# EasyEDA Pro project stm32devboard_f401ccu6.eprj

# Schematic Schematic1
Create Date: 2022-06-30; Project Name: stm32devboard_f401ccu6; Schematic Name: Schematic1; Update Date: 2022-07-04
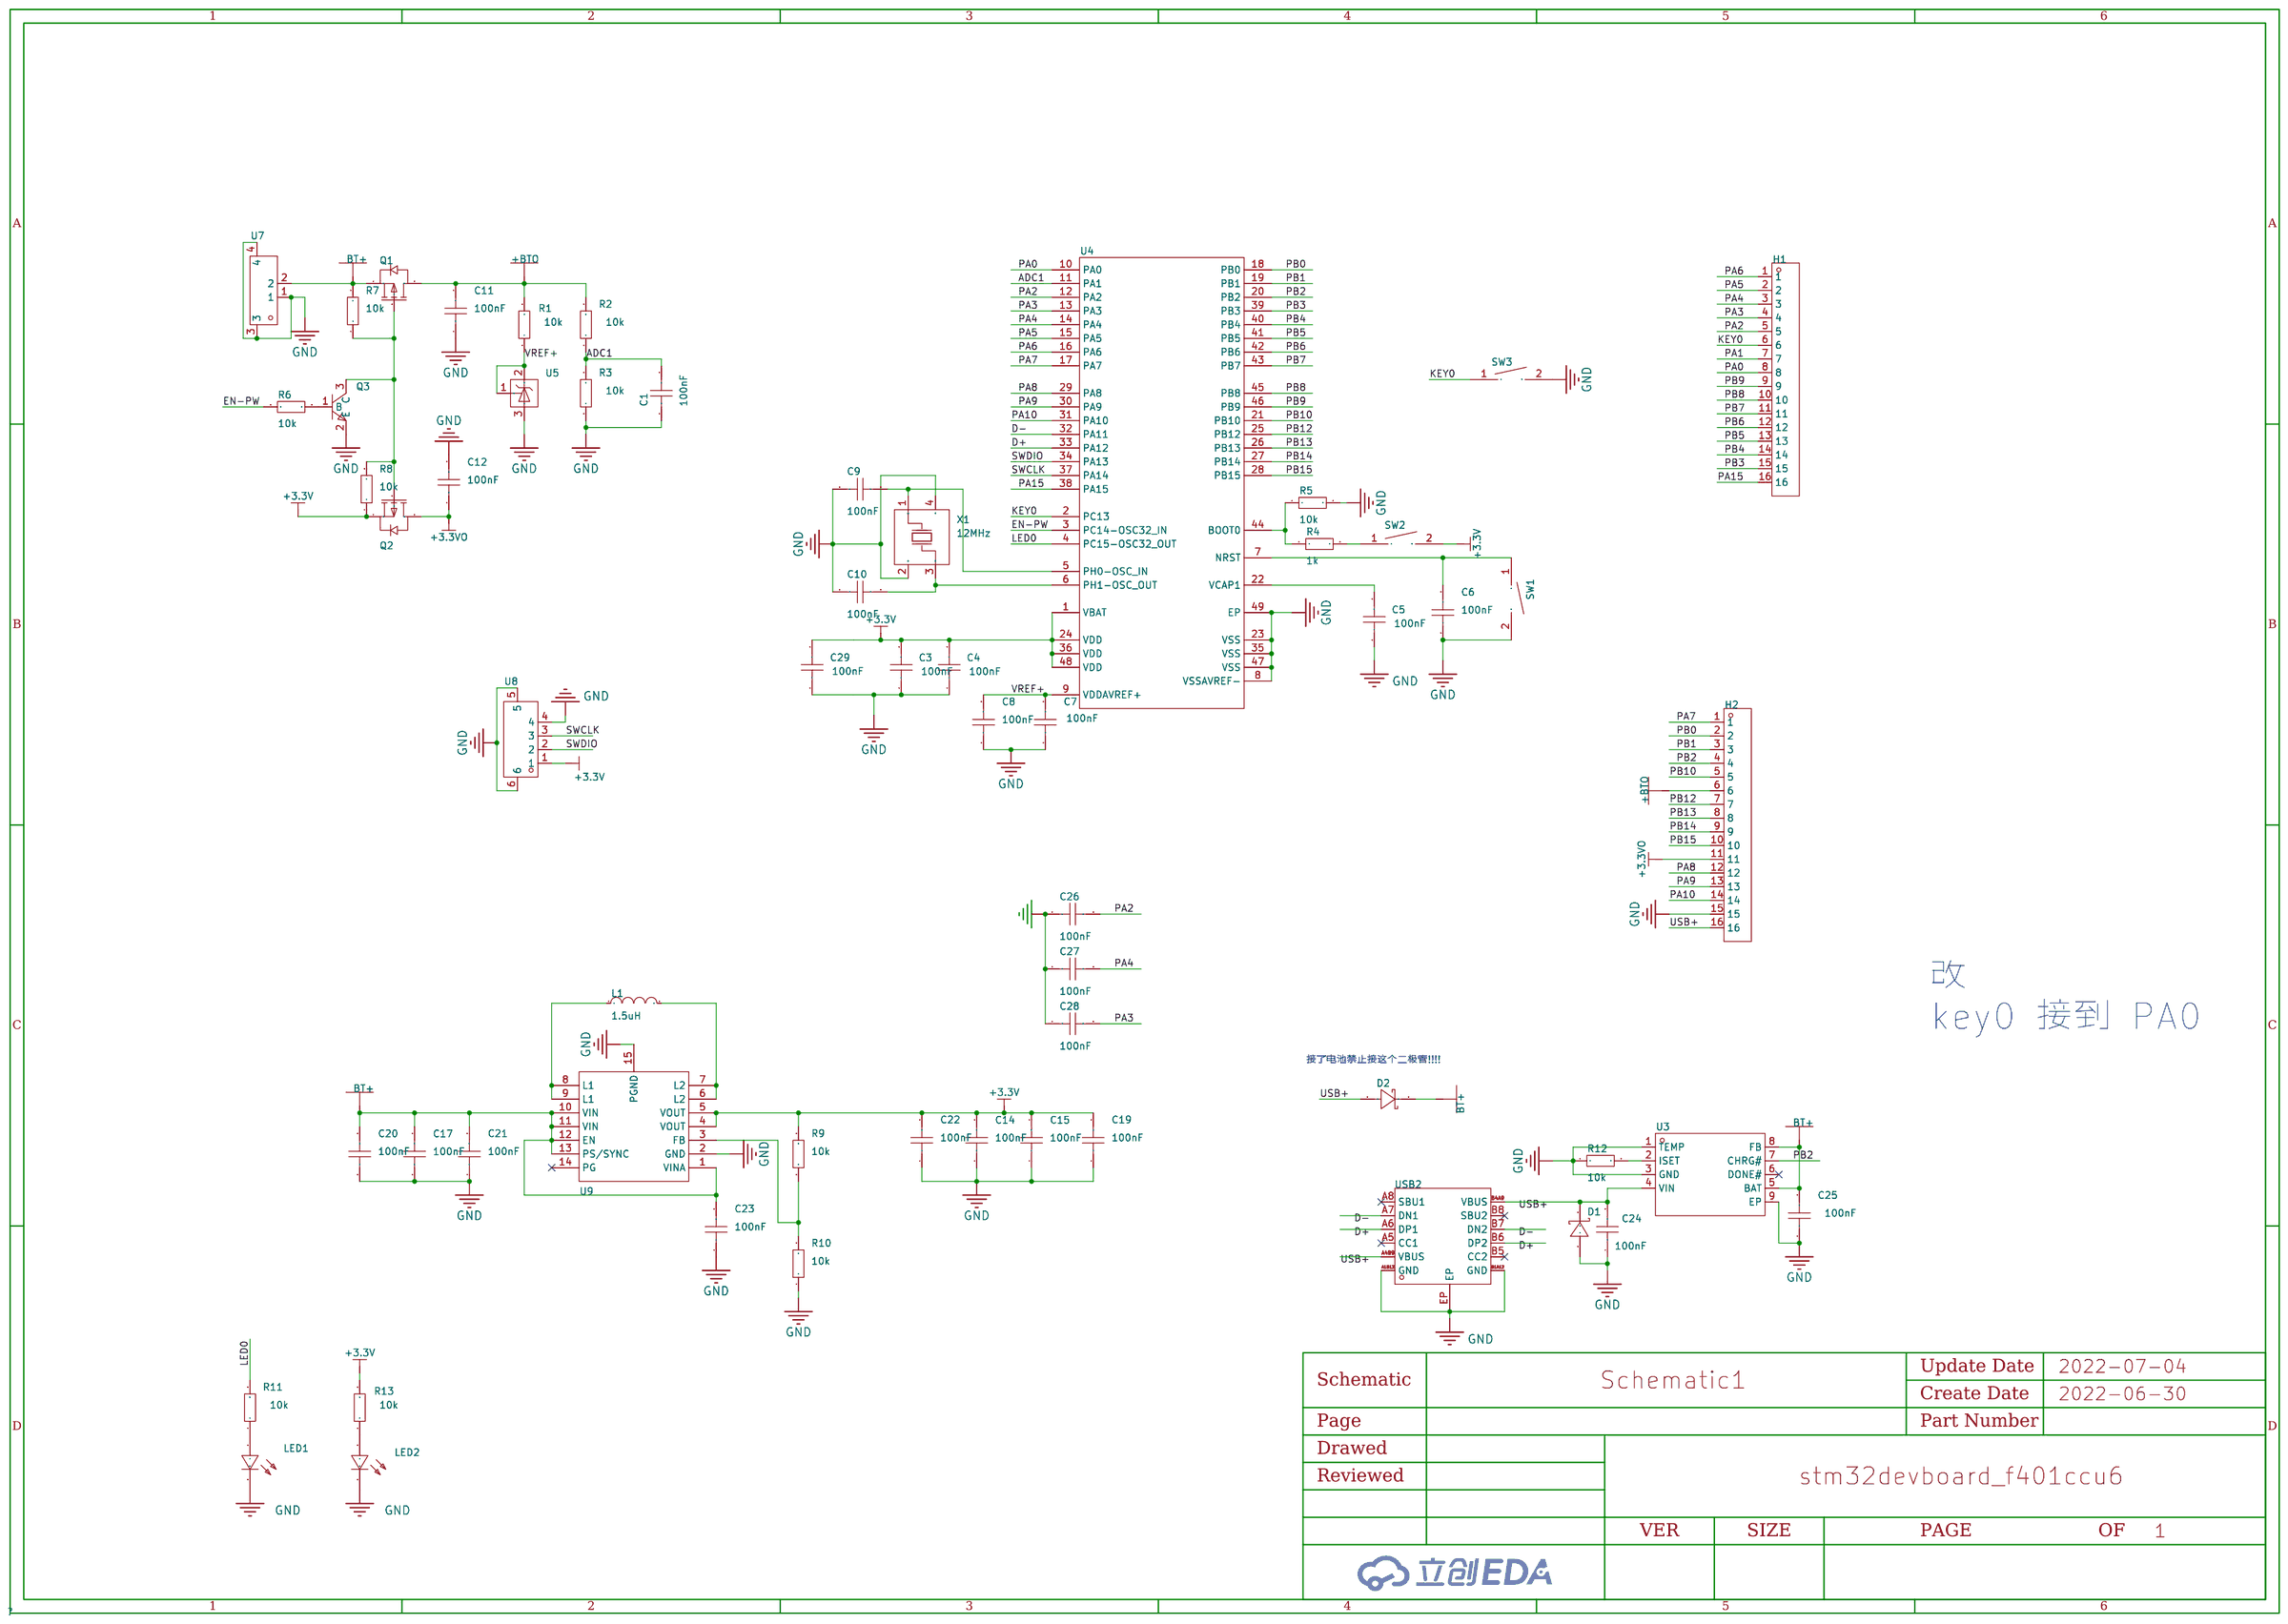
[diagram p0: schematic sheet]

## Parts
C1  100nF  [C0402]
C3  100nF  [C0603]
C4  100nF  [C0603]
C5  100nF  [C0603]
C6  100nF  [C0603]
C7  100nF  [C0603]
C8  100nF  [C0603]
C9  100nF  [C0603]
C10  100nF  [C0603]
C11  100nF  [C0603]
C12  100nF  [C0603]
C14  100nF  [C0603]
C15  100nF  [C0603]
C17  100nF  [C0603]
C19  100nF  [C0603]
C20  100nF  [C0603]
C21  100nF  [C0402]
C22  100nF  [C0402]
C23  100nF  [C0603]
C24  100nF  [C0603]
C25  100nF  [C0603]
C26  100nF  [C0402]
C27  100nF  [C0402]
C28  100nF  [C0402]
C29  100nF  [C0402]
D1  -  [SOD-123FL_L2.6-W1.6-LS3.4-R-FD]
D2  -  [SOD-323_L1.6-W1.3-LS2.7-RD]
H1  -  [HDR-TH_16P-P2.54-V-M]
H2  -  [HDR-TH_16P-P2.54-V-M]
L1  1.5uH  [IND-SMD_L4.0-W4.0_FNR40XXS]
LED1  -  [LED0603-R-RD]
LED2  -  [LED0603-R-RD]
Q1  -  [SOT-23-3_L2.9-W1.3-P1.90-LS2.4-TR]
Q2  -  [SOT-23-3_L2.9-W1.3-P1.90-LS2.4-TR]
Q3  -  [SOT-23-3_L2.9-W1.3-P1.90-LS2.4-BR]
R1  10k  [R0603]
R2  10k  [R0603]
R3  10k  [R0603]
R4  1k  [R0603]
R5  10k  [R0603]
R6  10k  [R0603]
R7  10k  [R0603]
R8  10k  [R0603]
R9  10k  [R0603]
R10  10k  [R0603]
R11  10k  [R0603]
R12  10k  [R0603]
R13  10k  [R0603]
SW1  -  [SW-SMD_L4.0-W2.9-LS5.0]
SW2  -  [SW-SMD_L4.0-W2.9-LS5.0]
SW3  -  [SW-SMD_L4.0-W2.9-LS5.0]
U3  -  [SOIC-8_L4.9-W3.9-P1.27-LS6.0-BL-EP3.3]
U4  -  [UFQFPN-48_L7.0-W7.0-P0.50-BL-EP]
U5  -  [SOT-23-3_L2.9-W1.3-P1.90-LS2.4-BR]
U7  -  [CONN-SMD_2P-P1.25_GH1.25-2P]
U8  -  [CONN-TH_4P-P1.25_XUNPU_WAFER-GH1.25-4PLB]
U9  -  [VSON-14_L4.0-W3.0-P0.50-BL-EP_TI_DSJ]
USB2  -  [USB-C-SMD_TYPE-C-16P-1]
X1  12MHz  [OSC-SMD_4P-L3.2-W2.5-BL]

## Library data of the parts
C1 C21 C22 C26-C29 = FN15X104K250PNG: 容值:100nF;精度:±10%;额定电压:25V;温度系数:X7R;; LCSC Part Name: 100nF ±10% 25V; Supplier Part: C525225; Manufacturer: PSA(信昌电陶); Supplier Footprint: 0402; JLCPCB Part Class: Extended Part; Datasheet: https://atta.szlcsc.com/upload/public/pdf/source/20200506/C436246_4EAA78C9048D88437BAF2CB7B8BE45FD.pdf; Supplier: LCSC; Tolerance: ±10%; Voltage Rated: 25V; Temperature Coefficient: X7R
C3-C12 C14 C15 C17 C19 C20 C23-C25 = CC0603KRX7R9BB104: 容值:100nF;精度:±10%;额定电压:50V;温度系数:X7R;; LCSC Part Name: 100nF ±10% 50V; Supplier Part: C14663; Manufacturer: YAGEO(国巨); Supplier Footprint: 0603; JLCPCB Part Class: Basic Part; Datasheet: https://atta.szlcsc.com/upload/public/pdf/source/20170116/1484561234239.pdf; Supplier: LCSC; Tolerance: ±10%; Voltage Rated: 50V; Temperature Coefficient: X7R
D1 = SMFJ5.0A: 极性:单向;反向截止电压(Vrwm):5V;击穿电压(最小值):6.4V;峰值脉冲电流(Ipp)@10/1000s:21.7A;最大钳位电压:9.4V;; LCSC Part Name: 单向 5V; Supplier Part: C151893; Manufacturer: BORN伯恩半导体; Supplier Footprint: SOD-123F; JLCPCB Part Class: Extended Part; Datasheet: https://atta.szlcsc.com/upload/public/pdf/source/20171211/C151893_15129764343031175501.pdf; Supplier: LCSC; Polarity: 单向; Reverse Stand-Off Voltage (Vrwm): 5V; Breakdown Voltage (Min): 6.4V; Peak Pulse Current (Ipp)@10/1000μs: 21.7A; Maximum Clamping Voltage: 9.4V
D2 = 1N5819WS S4: 二极管配置:独立式;直流反向耐压(Vr):40V;平均整流电流(Io):350mA;正向压降(Vf):600mV@200mA;反向电流(Ir):5A@30V;; LCSC Part Name: 40V 350mA 600mV@200mA; Supplier Part: C2927280; Manufacturer: JSMSEMI(杰盛微); Supplier Footprint: SOD-323; JLCPCB Part Class: Extended Part; Datasheet: https://atta.szlcsc.com/upload/public/pdf/source/20211230/020DF3ABCB41CBA5E28580D63AFB2CA3.pdf; Supplier: LCSC; Diode Configuration: 独立式; Reverse Voltage (Vr): 40V; Average Rectified Current (Io): 350mA; Forward Voltage (Vf@If): 600mV@200mA; Reverse Leakage Current (Ir): 5A@30V
H1 H2 = X5511WV-16-C396D43-1220: 2.54mm 圆孔排针,单排,180度,塑高3.0mm,塑宽2.54mm,D4.3mm,L=12.20mm,PPS料,镀金,16P; Supplier Part: C2883403; Manufacturer: XKB Connectivity(中国星坤); Supplier Footprint: 插件,P=2.54mm; JLCPCB Part Class: Extended Part; Datasheet: https://atta.szlcsc.com/upload/public/pdf/source/20211009/7D13F627EAEF227E7F3D2A55C463773D.pdf; Supplier: LCSC
L1 = FNR4030S1R5MT: 电感值:1.5uH;精度:±20%;额定电流:3.34A;直流电阻(DCR):26m;; LCSC Part Name: 1.5uH ±20% 3.34A 26m; Supplier Part: C167867; Manufacturer: cjiang(长江微电); Supplier Footprint: SMD; JLCPCB Part Class: Extended Part; Datasheet: https://atta.szlcsc.com/upload/public/pdf/source/20190327/C167867_08768CA7262D1F95412648A118D7A069.pdf; Supplier: LCSC; Tolerance: ±20%; Rated Current: 3.34A; DC Resistance (DCR): 26m
LED1 LED2 = 19-217/GHC-YR1S2/3T: 照明颜色:翠绿;色温 - CCT（K）:-;主波长/色坐标:520~535nm;; LCSC Part Name: 翠绿LED; Supplier Part: C72043; Manufacturer: EVERLIGHT(台湾亿光); Supplier Footprint: 0603; JLCPCB Part Class: Basic Part; Datasheet: https://atta.szlcsc.com/upload/public/pdf/source/20160507/1462613613780.pdf; Supplier: LCSC; Mounting Type: 表面贴装; Illumination Color: 翠绿; Luminous Intensity (IF=20mA): 112~258mcd; Dominant Wavelength / Coordinate rank: 520~535nm
Q1 Q2 = AP2301B: 类型:P沟道;漏源电压(Vdss):20V;连续漏极电流(Id):2A;功率(Pd):750mW;导通电阻(RDS(on)@Vgs,Id):130m@4.5V,2A;阈值电压(Vgs(th)@Id):950mV@250uA;栅极电荷(Qg@Vgs):-;输入电容(Ciss@Vds):210pF@6V;反向传输电容(Crss@Vds):27pF@6V;; LCSC Part Name: P沟道 20V 2A; Supplier Part: C2763847; Manufacturer: ALLPOWER(铨力); Supplier Footprint: SOT-23-3; JLCPCB Part Class: Extended Part; Datasheet: https://atta.szlcsc.com/upload/public/pdf/source/20210401/C2763847_842F2A0FFE6F1F01F619022F78C12F29.pdf; Supplier: LCSC; Type: P沟道; Drain Source Voltage (Vdss): 20V; Continuous Drain Current (Id): 2A; Power Dissipation (Pd): 750mW; Drain Source On Resistance (RDS(on)@Vgs,Id): 130m@4.5V,2A; Gate Threshold Voltage (Vgs(th)@Id): 950mV@250uA; Input Capacitance (Ciss@Vds): 210pF@6V; Reverse Transfer Capacitance (Crss@Vds): 27pF@6V
Q3 = S8050 J3Y: LCSC Part Name: S8050; Supplier Part: C2926165; Manufacturer: FOSAN(富信); Supplier Footprint: SOT-23; JLCPCB Part Class: Extended Part; Datasheet: https://atta.szlcsc.com/upload/public/pdf/source/20211203/FAF9E446EEEFA352739C30D23AB52B1B.pdf; Supplier: LCSC
R1-R13 = TR0603B10K0P0525Z: 电阻类型:薄膜电阻;阻值:10k;精度:±0.1%;功率:100mW;温度系数:±25ppm/;最大工作电压:75V;工作温度范围:-55~+155;; LCSC Part Name: 10k ±0.1% 100mW; Supplier Part: C188363; Manufacturer: EVER OHMS(天二科技); Supplier Footprint: 0603; JLCPCB Part Class: Extended Part; Datasheet: https://atta.szlcsc.com/upload/public/pdf/source/20190415/C188363_433BF05B6FB8F7A0F5F35A3E4390C55A.pdf; Supplier: LCSC; Type: 薄膜电阻; Tolerance: ±0.1%; Power(Watts): 100mW; Temperature Coefficient: ±25ppm/; Overload Voltage (Max): 75V; Operating Temperature Range: -55~+155
SW1-SW3 = TSA343G00-250J2: 触点电流:50mA;额定电压(DC):12V;绝缘电阻:100M;电路结构:单刀单掷;安装方式:立贴;按钮形状:圆形按钮;按钮/盖帽颜色:黑色;带灯:无;作用力:250gf@±50gf;机械寿命:50000;工作温度:-25~+70;引脚样式:SMD接片;开关长度:3.95mm;开关宽度:2.9mm;开关高度:2mm;带支架:否;; LCSC Part Name: 3*4 两脚小龟不带柱  250gf; Supplier Part: C354946; Manufacturer: BRIGHT(博瑞泰); Supplier Footprint: SMD; JLCPCB Part Class: Extended Part; Datasheet: https://atta.szlcsc.com/upload/public/pdf/source/20190426/C354946_6B70DFBDFA823D17B8EB46FB9599F693.pdf; Supplier: LCSC; Contact Current: 50mA; Voltage Rating (DC): 12V; Insulation Resistance: 100M; Circuit: 单刀单掷; Mounting Style: 立贴; Actuator Style: 圆形按钮; Actuator/Cap Color: 黑色; With Lamp: 无; Operating Force: 250gf@±50gf; Mechanical Life: 50000; Operating Temperature: -25~+70; Pin Style: SMD接片; Switch Length: 3.95mm; Switch Width: 2.9mm; Switch Height: 2mm; Strike Gundam: 否
U3 = CN3058E: 充电电池的类型:-;电池单元组数:-;最大充电电流:-;充满的电池组电压:-;最大供应电压:-;; Supplier Part: C112011; Manufacturer: CONSONANCE(上海如韵); Supplier Footprint: SOP-8_150mil; JLCPCB Part Class: Extended Part; Datasheet: https://atta.szlcsc.com/upload/public/pdf/source/20170717/C112011_1500269941276820724.pdf; Supplier: LCSC
U4 = STM32F401CEU6: 主频（MAX):84MHz;工作电压:1.7V ~ 3.6V;; Supplier Part: C161736; Manufacturer: ST(意法半导体); Supplier Footprint: UFQFPN-48; JLCPCB Part Class: Extended Part; Datasheet: https://atta.szlcsc.com/upload/public/pdf/source/20180130/C161736_15172973410651323369.pdf; Supplier: LCSC; Speed: 84MHz; Voltage - Supply (Vcc/Vdd): 1.7V ~ 3.6V; Program Memory Size: 512KB; RAM Size: 96KB; Number of I/O: 36; A/D: 10x12bit; PWM: 6; UART/USART: 3 USART; SPI: 3; I2C（SMBUS/PMBUS）: 3; USB Device: 1; USB Host/OTG: 1; Features: IrDA,LIN,SDIO
U5 = TL431: Supplier Part: C2914425; Manufacturer: MSKSEMI(美森科); Supplier Footprint: SOT-23; Datasheet: https://atta.szlcsc.com/upload/public/pdf/source/20220331/21EBFB8FAE95C5EE73F8EC33D24361D7.pdf; Supplier: LCSC
U7 = GH1.25-2PLTPZ: LCSC Part Name: GH1.25-2P立贴编带加盖; Supplier Part: C2829260; Manufacturer: BOOMELE(博穆精密); JLCPCB Part Class: Extended Part; Datasheet: https://atta.szlcsc.com/upload/public/pdf/source/20211125/08A09A4909F58AF780B71FE423A00F7E.pdf; Supplier: LCSC
U8 = WAFER-GH1.25-4PLB: LCSC Part Name: GH1.25mm 4P 立贴带扣; Supplier Part: C3029370; Manufacturer: XUNPU(讯普); Supplier Footprint: SMD,P=1.25mm; Datasheet: https://atta.szlcsc.com/upload/public/pdf/source/20220527/44F824AAC8C2B617205E15955FF9C23D.pdf; Supplier: LCSC
U9 = TPS63020DSJR: 功能类型:升降压型;同步整流:是;输出通道数:1;拓扑结构:降压-升压式;输入电压:1.8V~5.5V;输出电压:1.2V~5.5V;输出电流(最大值):3.5A;开关频率:2.4MHz;; LCSC Part Name: 升降压型 1.8V~5.5V 3.5A 2.4MHz; Supplier Part: C15483; Manufacturer: TI(德州仪器); Supplier Footprint: VSON-14_3x4x05P; JLCPCB Part Class: Extended Part; Datasheet: https://atta.szlcsc.com/upload/public/pdf/source/20140704/1457707124625.pdf; Supplier: LCSC; Function: 升降压型; Synchronous Rectification: 是; Number of Outputs: 1; Topology: 降压-升压式; Input Voltage: 1.8V~5.5V; Output Voltage: 1.2V~5.5V; Output Current (Max): 3.5A; Switching Frequency: 2.4MHz
USB2 = TYPEC-304-ACP16: 连接器类型:Type-C;公母:母座;触点数量:16;端口数量:1;安装方式:卧贴;额定电流 - 电源:3A;工作温度范围:-40~+85;; LCSC Part Name: Type-C 母座 卧贴; Supplier Part: C2982555; Manufacturer: XUNPU(讯普); Supplier Footprint: SMD; JLCPCB Part Class: Extended Part; Datasheet: https://atta.szlcsc.com/upload/public/pdf/source/20220311/3C907F75E12F45E4EE7F73565AB9C294.pdf; Supplier: LCSC; Connector Type: Type-C; Gender: 母座; Number of Contacts: 16; Number of Ports: 1; Mounting Style: 卧贴; Current Rating - Power (Max): 3A; Operating Temperature Range: -40~+85
X1 = X322512MSB4SI: 晶振类型:贴片无源晶振;频率:12MHz;频率公差:±10ppm;频率稳定度:±30ppm;负载电容:20pF;工作温度:-40~+85;; LCSC Part Name: 12MHz ±10ppm 20pF; Supplier Part: C9002; Manufacturer: YXC扬兴科技; Supplier Footprint: SMD3225-4P; JLCPCB Part Class: Basic Part; Datasheet: https://atta.szlcsc.com/upload/public/pdf/source/20210329/C112971_1F611BDC486E193C1706F6D8EB5AA189.pdf; Supplier: LCSC; Crystal Type: 贴片无源晶振; Frequency Tolerance: ±10ppm; Frequency Stability: ±30ppm; Load Capacitance: 20pF; Operating Temperature: -40~+85

## Nets
+3.3V: C3.2 C4.2 C14.2 C15.2 C19.2 C22.2 C29.2 Q2.1(S) R8.1 R9.2 R13.2 SW2.2 U4.1(VBAT) U4.24(VDD) U4.36(VDD) U4.48(VDD) U8.1 U9.4(VOUT) U9.5(VOUT)
+3.3VO: C12.1 H2.11 Q2.3(D)
GND: C1.1 C3.1 C4.1 C5.1 C6.1 C7.1 C8.1 C9.1 C10.1 C11.1 C12.2 C14.1 C15.1 C17.1 C19.1 C20.1 C21.1 C22.1 C23.1 C24.1 C25.1 C26.1 C27.1 C28.1 C29.1 D1.2(A) H2.15 LED1.2(C) LED2.2(C) Q3.2(E) R3.1 R5.2 R10.1 R12.1 SW1.2 SW3.2 U3.1(TEMP) U3.3(GND) U3.9(EP) U4.8(VSSAVREF-) U4.23(VSS) U4.35(VSS) U4.47(VSS) U4.49(EP) U5.3(A) U7.1 U7.3 U7.4 U8.4 U8.5 U8.6 U9.2(GND) U9.15(PGND) USB2.A1B12(GND) USB2.B1A12(GND) USB2.EP X1.2(GND) X1.4(GND)
+BTO: C11.2 H2.6 Q1.3(D) R1.2 R2.2
ADC1: C1.2 R2.1 R3.2 U4.11(PA1)
BT+: C17.2 C20.2 C21.2 C23.2 C25.2 D2.1(C) Q1.1(S) R7.2 U3.5(BAT) U3.8(FB) U7.2 U9.1(VINA) U9.10(VIN) U9.11(VIN) U9.12(EN) U9.13(PS/SYNC)
D+: U4.33(PA12) USB2.A6(DP1) USB2.B6(DP2)
D-: U4.32(PA11) USB2.A7(DN1) USB2.B7(DN2)
EN-PW: R6.1 U4.3(PC14-OSC32_IN)
KEY0: H1.6 SW3.1 U4.2(PC13)
LED0: R11.2 U4.4(PC15-OSC32_OUT)
PA0: H1.8 U4.10(PA0)
PA1: H1.7
PA2: C26.2 H1.5 U4.12(PA2)
PA3: C28.2 H1.4 U4.13(PA3)
PA4: C27.2 H1.3 U4.14(PA4)
PA5: H1.2 U4.15(PA5)
PA6: H1.1 U4.16(PA6)
PA7: H2.1 U4.17(PA7)
PA8: H2.12 U4.29(PA8)
PA9: H2.13 U4.30(PA9)
PA10: H2.14 U4.31(PA10)
PA15: H1.16 U4.38(PA15)
PB0: H2.2 U4.18(PB0)
PB1: H2.3 U4.19(PB1)
PB2: H2.4 U3.7(CHRG#) U4.20(PB2)
PB3: H1.15 U4.39(PB3)
PB4: H1.14 U4.40(PB4)
PB5: H1.13 U4.41(PB5)
PB6: H1.12 U4.42(PB6)
PB7: H1.11 U4.43(PB7)
PB8: H1.10 U4.45(PB8)
PB9: H1.9 U4.46(PB9)
PB10: H2.5 U4.21(PB10)
PB12: H2.7 U4.25(PB12)
PB13: H2.8 U4.26(PB13)
PB14: H2.9 U4.27(PB14)
PB15: H2.10 U4.28(PB15)
SWCLK: U4.37(PA14) U8.3
SWDIO: U4.34(PA13) U8.2
USB+: C24.2 D1.1(K) D2.2(A) H2.16 U3.4(VIN) USB2.A4B9(VBUS) USB2.B4A9(VBUS)
VREF+: C7.2 C8.2 R1.1 U4.9(VDDAVREF+) U5.1(REF) U5.2(C)
$1N3171: R4.1 R5.1 U4.44(BOOT0)
$1N3579: R4.2 SW2.1
$1N4950: C5.2 U4.22(VCAP1)
$1N5109: C6.2 SW1.1 U4.7(NRST)
$1N7030: C10.2 U4.6(PH1-OSC_OUT) X1.3(OSC2)
$1N7055: C9.2 U4.5(PH0-OSC_IN) X1.1(OSC1)
$1N11417: Q3.1(B) R6.2
$1N11548: Q1.2(G) Q2.2(G) Q3.3(C) R7.1 R8.2
$1N17740: L1.1 U9.8(L1) U9.9(L1)
$1N17819: L1.2 U9.6(L2) U9.7(L2)
$1N22362: R9.1 R10.2 U9.3(FB)
$1N29393: LED1.1(A) R11.1
$1N31043: R12.2 U3.2(ISET)
$1N41930: LED2.1(A) R13.1

Not connected (* = marked no-connect by the designer): U3 6(DONE#)*; U9 14(PG)*; USB2 A5(CC1)* A8(SBU1)* B5(CC2)* B8(SBU2)*

## Notes on the sheet
- 改
  key0 接到 PA0
- 接了电池禁止接这个二极管!!!!

# Board pcb1
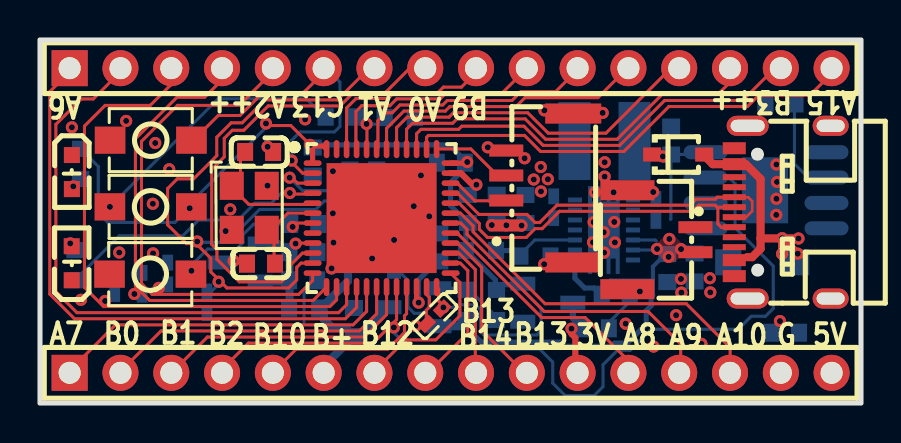
[diagram p1: board, top side]
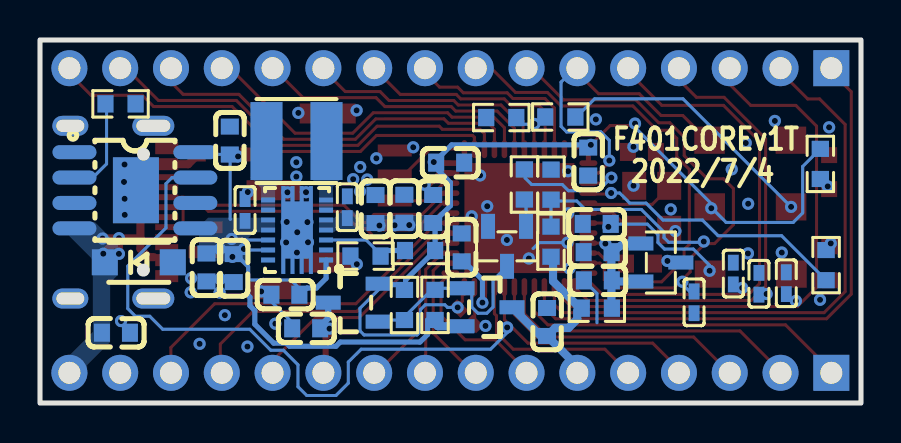
[diagram p2: board, bottom side, seen from below]

Outline 41.05 x 18.16 mm; copper layers: Top Layer, Bottom Layer. Coordinates in mm from the lower left corner of the outline.
Outline path: rectangle 0,18.16 41.05,0
Stack: Top Layer 0.035mm / 介电1 1.51mm FR4 er 4.5 / Bottom Layer 0.035mm

## Design rules (mm)
net D-: DP1
net D+: DP1
spacing safeClearance (default): track to track 0.152, other pairs 0.152 to 0.3
track width trackWidth (default): min 0.127, default 0.152, max 2.54
differential pair differentialPair (default): width min 0.127, default 0.254, max 2.54; gap min 0.152, default 0.152
via viaSize (default): diameter min 0.5, default 0.61, max 10; hole min 0.3, default 0.305, max 6

## Placement (name value [footprint] x y rotation side)
C1  100nF  [C0402]  8.35 5.04 90 bottom
C3  100nF  [C0603]  13.64 12.08 90 bottom
C4  100nF  [C0603]  20.54 12.03 0 bottom
C5  100nF  [C0603]  19.97 7.78 270 bottom
C6  100nF  [C0603]  13.21 8.96 180 bottom
C7  100nF  [C0603]  13.16 6.14 180 bottom
C8  100nF  [C0603]  13.17 7.55 180 bottom
C9  100nF  [C0603]  10.96 12.56 180 top
C10  100nF  [C0603]  11.05 6.97 0 top
C11  100nF  [C0603]  15.7 4.05 270 bottom
C12  100nF  [C0603]  27.74 3.74 0 bottom
C14  100nF  [C0603]  21.39 9.71 270 bottom
C15  100nF  [C0603]  24.28 9.7 270 bottom
C17  100nF  [C0603]  31.37 6.75 90 bottom
C19  100nF  [C0603]  22.84 9.72 270 bottom
C20  100nF  [C0603]  32.73 6.78 90 bottom
C21  100nF  [C0402]  30.8 9.66 270 bottom
C22  100nF  [C0402]  25.69 9.8 270 bottom
C23  100nF  [C0603]  28.78 5.42 180 bottom
C24  100nF  [C0603]  37.26 3.52 0 bottom
C25  100nF  [C0603]  31.56 13.13 270 bottom
C26  100nF  [C0402]  6.39 6.48 270 bottom
C27  100nF  [C0402]  3.74 5.99 270 bottom
C28  100nF  [C0402]  5.1 5.97 270 bottom
C29  100nF  [C0402]  19.72 4.34 45 top
D1  -  [SOD-123FL_L2.6-W1.6-LS3.4-R-FD]  36.11 7.04 0 bottom
D2  -  [SOD-323_L1.6-W1.3-LS2.7-RD]  31.91 12.43 0 top
H1  -  [HDR-TH_16P-P2.54-V-M]  20.53 16.75 0 top
H2  -  [HDR-TH_16P-P2.54-V-M]  20.53 1.51 0 top
L1  1.5uH  [IND-SMD_L4.0-W4.0_FNR40XXS]  28.23 13.11 180 bottom
LED1  -  [LED0603-R-RD]  1.59 6.99 90 top
LED2  -  [LED0603-R-RD]  1.59 11.55 270 top
Q1  -  [SOT-23-3_L2.9-W1.3-P1.90-LS2.4-TR]  18.7 4.79 0 bottom
Q2  -  [SOT-23-3_L2.9-W1.3-P1.90-LS2.4-TR]  25.39 5.02 180 bottom
Q3  -  [SOT-23-3_L2.9-W1.3-P1.90-LS2.4-BR]  17.7 7.84 90 bottom
R1  10k  [R0603]  13.21 4.74 0 bottom
R2  10k  [R0603]  15.5 8.07 270 bottom
R3  10k  [R0603]  15.5 10.92 270 bottom
R4  1k  [R0603]  15.04 14.31 180 bottom
R5  10k  [R0603]  17.99 14.28 0 bottom
R6  10k  [R0603]  16.83 10.93 270 bottom
R7  10k  [R0603]  21.3 4.91 270 bottom
R8  10k  [R0603]  22.83 4.9 270 bottom
R9  10k  [R0603]  22.05 7.63 180 bottom
R10  10k  [R0603]  24.78 7.35 180 bottom
R11  10k  [R0603]  1.75 6.9 270 bottom
R12  10k  [R0603]  37.03 14.97 0 bottom
R13  10k  [R0603]  2.03 11.96 90 bottom
SW1  -  [SW-SMD_L4.0-W2.9-LS5.0]  5.51 6.45 180 top
SW2  -  [SW-SMD_L4.0-W2.9-LS5.0]  5.53 9.81 0 top
SW3  -  [SW-SMD_L4.0-W2.9-LS5.0]  5.54 13.15 180 top
U3  -  [SOIC-8_L4.9-W3.9-P1.27-LS6.0-BL-EP3.3]  36.31 10.64 270 bottom
U4  -  [UFQFPN-48_L7.0-W7.0-P0.50-BL-EP]  17.08 9.25 270 top
U5  -  [SOT-23-3_L2.9-W1.3-P1.90-LS2.4-BR]  10.01 7.03 0 bottom
U7  -  [CONN-SMD_2P-P1.25_GH1.25-2P]  31.07 8.17 270 top
U8  -  [CONN-TH_4P-P1.25_XUNPU_WAFER-GH1.25-4PLB]  24.99 10.76 90 top
U9  -  [VSON-14_L4.0-W3.0-P0.50-BL-EP_TI_DSJ]  28.2 8.66 90 bottom
USB2  -  [USB-C-SMD_TYPE-C-16P-1]  37.13 9.55 90 top
X1  12MHz  [OSC-SMD_4P-L3.2-W2.5-BL]  10.47 9.77 270 top

## Footprints (pads in the part's own frame, mm; a bottom-side part is the same pattern mirrored in y, then rotated)
C0402
  rect 0.79x0.54 smd: 1(-0.545,0) 2(0.545,0)
C0603
  rect 0.8x0.9 smd: 1(-0.7,0) 2(0.7,0)
CONN-SMD_2P-P1.25_GH1.25-2P
  rect 0.6x1.7 smd: 1(-0.625,1.702) 2(0.625,1.702)
  rect 1.001x2.7 smd: 3(2.474,-1.702) 4(-2.474,-1.696)
CONN-TH_4P-P1.25_XUNPU_WAFER-GH1.25-4PLB
  rect 0.6x1.7 smd: 1(-1.875,1.675) 2(-0.625,1.675) 3(0.625,1.675) 4(1.875,1.675)
  rect 1x2.8 smd: 5(-3.725,-1.675) 6(3.725,-1.675)
HDR-TH_16P-P2.54-V-M
  rect 1.801x1.801 hole 1.1: 1(-19.05,0)
  round 1.801 hole 1.1: 2(-16.51,0) 3(-13.97,0) 4(-11.43,0) 5(-8.89,0) 6(-6.35,0) 7(-3.81,0) 8(-1.27,0) 9(1.27,0) 10(3.81,0) 11(6.35,0) 12(8.89,0) 13(11.43,0) 14(13.97,0) 15(16.51,0) 16(19.05,0)
IND-SMD_L4.0-W4.0_FNR40XXS
  rect 1.6x3.899 smd: 1(-1.501,0) 2(1.501,0)
LED0603-R-RD
  rect 0.8x0.8 smd: 1(0.851,0) 2(-0.851,0)
OSC-SMD_4P-L3.2-W2.5-BL
  rect 1.4x1.2 smd: 1(-1.1,-0.875) 2(1.1,-0.875) 3(1.1,0.875) 4(-1.1,0.875)
R0603
  rect 0.806x0.864 smd: 1(-0.753,0) 2(0.753,0)
SOD-123FL_L2.6-W1.6-LS3.4-R-FD
  rect 1.3x1.3 smd: 1(1.7,0) 2(-1.7,0)
SOD-323_L1.6-W1.3-LS2.7-RD
  rect 0.899x0.701 smd: 1(-1.3,0) 2(1.3,0)
SOIC-8_L4.9-W3.9-P1.27-LS6.0-BL-EP3.3
  oval 0.701x2.2 smd: 1(-1.905,-3.022) 2(-0.635,-3.022) 3(0.635,-3.022) 4(1.905,-3.022) 5(1.905,3.022) 6(0.635,3.022) 7(-0.635,3.022) 8(-1.905,3.022)
  rect 3.3x2.301 smd: 9(0,0.051)
SOT-23-3_L2.9-W1.3-P1.90-LS2.4-BR
  rect 1.25x0.7 smd: 1(1,-0.95) 2(1,0.95) 3(-1,0)
SOT-23-3_L2.9-W1.3-P1.90-LS2.4-TR
  rect 1.25x0.701 smd: 1(1.25,0.95) 2(1.25,-0.95) 3(-1.25,0)
SW-SMD_L4.0-W2.9-LS5.0
  rect 1.53x1.36 smd: 1(-2.035,0) 2(2.035,0)
UFQFPN-48_L7.0-W7.0-P0.50-BL-EP
  oval 0.28x0.899 smd: 1(-2.751,-3.45) 2(-2.251,-3.45) 3(-1.75,-3.45) 4(-1.25,-3.45) 5(-0.75,-3.45) 6(-0.249,-3.45) 7(0.249,-3.45) 8(0.75,-3.45) 9(1.25,-3.45) 10(1.75,-3.45) 11(2.251,-3.45) 12(2.751,-3.45) 25(2.751,3.45) 26(2.251,3.45) 27(1.75,3.45) 28(1.25,3.45) 29(0.75,3.45) 30(0.249,3.45) 31(-0.249,3.45) 32(-0.75,3.45) 33(-1.25,3.45) 34(-1.75,3.45) 35(-2.251,3.45) 36(-2.751,3.45)
  oval 0.899x0.28 smd: 13(3.45,-2.751) 14(3.45,-2.251) 15(3.45,-1.75) 16(3.45,-1.25) 17(3.45,-0.75) 18(3.45,-0.249) 19(3.45,0.249) 20(3.45,0.75) 21(3.45,1.25) 22(3.45,1.75) 23(3.45,2.251) 24(3.45,2.751) 37(-3.45,2.751) 38(-3.45,2.251) 39(-3.45,1.75) 40(-3.45,1.25) 41(-3.45,0.75) 42(-3.45,0.249) 43(-3.45,-0.249) 44(-3.45,-0.75) 45(-3.45,-1.25) 46(-3.45,-1.75) 47(-3.45,-2.251) 48(-3.45,-2.751)
  rect 5.499x5.499 smd: 49(0,0)
USB-C-SMD_TYPE-C-16P-1
  rect 0.6x1.15 smd: A1B12(-3.2,2.41) A4B9(-2.4,2.41) B1A12(3.2,2.41) B4A9(2.4,2.41)
  rect 0.3x1.15 smd: A5(-1.25,2.41) A6(-0.25,2.41) A7(0.25,2.41) A8(1.25,2.41) B5(1.75,2.41) B6(0.75,2.41) B7(-0.75,2.41) B8(-1.75,2.41)
  oval 1x2.1 hole 0.6x1.7: EP(-4.32,1.74) EP(4.32,1.74)
  oval 1x1.8 hole 0.6x1.4: EP(-4.32,-2.41) EP(4.32,-2.41)
VSON-14_L4.0-W3.0-P0.50-BL-EP_TI_DSJ
  rect 0.25x0.7 smd: 1(-1.5,-1.45) 2(-1,-1.45) 3(-0.5,-1.45) 4(0,-1.45) 5(0.5,-1.45) 6(1,-1.45) 7(1.5,-1.45) 8(1.5,1.45) 9(1,1.45) 10(0.5,1.45) 11(0,1.45) 12(-0.5,1.45) 13(-1,1.45) 14(-1.5,1.45)
  custom 4.4x1.58 smd: 15(0,0)

## Nets
As in the schematic, except:
PA1: C1.2 H1.7 R2.1 R3.2 U4.11

Pads without a net: U3 6; U9 14; USB2 A5 A8 B5 B8

## Via types
v1: diameter 0.61, hole 0.305, Top Layer to Bottom Layer, 94 vias

## Routing (per net, layer and track width the routed paths; a pad name or vN(x,y) marks a point on that pad's centre or on a via; arc(x,y) is an arc through that point)
+3.3V: length 46.6
  Top Layer w0.152: U4.24 19.94,5.7 19.94,5.09 20.11,4.92 C29.2 ; 11.33,13.88 12.54,13.88 v1(13.51,12.91)
  Top Layer w0.254: U4.1 13.63,12.84 13.53,12.94 ; 13.53,12.94 13.56,12.91 ; 13.53,12.94 13.62,12.85 ; 13.53,12.94 13.62,12.85 ; 21.4,11.92 21.32,12 20.53,12 ; 13.62,12.85 14.18,12.85 U4.48 ; 13.62,12.85 13.58,12.85
  Bottom Layer w0.152: R13.2 2.92,11.83 2.92,9.51 3.4,9.03 6.74,9.03 7.42,9.72 ; v1(11.3,13.98) 11.3,13.79 7.49,9.97 7.49,9.74 ; 24.1,5.69 25.05,4.74 25.05,3.61 24.85,3.41 22.2,3.41 22.03,3.58 22.03,4.68 21.79,4.92 20.81,4.92 20.68,4.78 v1(20.17,4.78)
  Bottom Layer w0.254: C14.2 20.53,9.87 20.53,11.03 21.12,11.63 21.12,11.9 ; R8.1 23.09,5.92 24.08,5.92 ; 22.78,5.67 22.78,6.15 R9.2 21.3,8.87 21.38,8.95 ; v1(13.51,12.91) 20.47,12.91 21.2,12.19
  vias: v1(7.49,9.75) v1(21.36,12.06) v1(22.59,8.9) v1(23.32,8.89) v1(24.08,8.88)
+3.3VO: length 3.5
  Top Layer w0.305: 26.77,1.71 26.77,3.26 26.58,3.46 v1(26.58,3.72)
  Bottom Layer w0.305: 27.11,3.77 26.64,4.24 Q2.3
GND: length 9.6
  Top Layer w0.152: U4.23 19.33,5.42 19.47,5.29 19.47,4.79 19.32,4.64 19.32,4.21 19.36,4.16
  Top Layer w0.305: 20.53,11.5 21.04,11.5 21.62,10.92
  Bottom Layer w0.152: v1(14.68,8.03) 16.1,8.03 16.4,7.73 ; 13.86,6.14 13.2,5.48 13.2,4.02 ; v1(30,5.58) 28.38,3.96
  vias: v1(1.59,13.79) v1(2.05,5.16) v1(3.96,7.53) v1(4.31,14.11) v1(5.64,9.97) v1(5.65,7.48) v1(5.76,13.01) v1(6.46,11.69) v1(9.28,8.6) v1(9.51,9.69) v1(9.68,7.11) v1(11.38,12.82) v1(11.38,10.87) v1(13.26,14.19) v1(14.58,6.73) v1(14.65,11.6) v1(14.65,9.49) v1(16.61,7.23) v1(17.71,8.16) v1(18.69,9.85) v1(18.78,3.86) v1(19.05,11.39) v1(19.47,9.34) v1(21.82,10.92) v1(22.39,12.79) v1(24.23,12.24) v1(24.69,11.18) v1(25.04,11.81) v1(25.05,10.59) v1(25.22,14.64) v1(25.21,6.95) v1(25.4,11.2) v1(27.68,9.05) v1(27.65,8.04) v1(27.75,10.55) v1(28.14,14.51) v1(28.19,8.54) v1(28.21,7.53) v1(28.24,12.04) v1(28.24,11.33) v1(28.68,10.54) v1(28.72,9.06) v1(28.75,8.03) v1(29.29,3.97) v1(30.66,10.55) v1(30.68,2.82) v1(31.81,4.39) v1(32.05,6.21) v1(32.07,5.53) v1(33.07,2.96) v1(33.5,6.24) v1(33.52,5.54) v1(36.83,11.93) v1(36.82,10.22) v1(36.82,9.41) v1(36.85,11.06) v1(37,4.1)
+BTO: length 10
  Bottom Layer w0.406: 14.13,4.83 15.4,6.1 15.4,7.15 15.48,7.23 ; 14.19,4.62 14.19,4.19 14.62,3.76 15.29,3.76 C11.2 14.2,1.85 14.2,1.46 ; Q1.3 15.97,3.31 15.83,3.31
BT+: length 28.4
  Bottom Layer w0.152: U9.13 30.81,7.66 30.85,7.62 ; C25.2 31.55,12.41 31.55,9.21 31.53,9.19 ; U9.12 30.77,8.16 30.82,8.1 ; 31.55,12.44 33.43,12.44 33.54,12.55 ; 27.97,5.62 28.51,6.16 30.62,6.16 30.65,6.18 30.66,6.2
  Bottom Layer w0.203: 30.65,5.39 30.65,6.82 31.01,7.18
  Bottom Layer w0.254: U9.1 26.75,6.24 27.23,5.75 27.69,5.75 27.73,5.72 ; 30.65,5.39 30.55,5.3 30.55,4.87 30.31,4.62 30.31,3.94 29.37,3 28.73,3 28.58,2.84 26.25,2.84 26.04,3.05 22.05,3.05 21.67,3.43 21.67,4.16 R7.2
  Bottom Layer w0.406: 21.47,4.16 21.16,3.84 Q1.1
  vias: v1(30.86,7.71) v1(31.15,12.34) v1(31.43,7.31) v1(31.47,8.21) v1(32.05,7.7)
D+: length 17.6
  Top Layer w0.127: USB2.A6 35.31,9.3 35.61,9.6 35.61,10.1 35.42,10.29 34.94,10.29 34.93,10.28
  Top Layer w0.152: USB2.B6 33.86,10.3 33.77,10.2 32.81,10.2 32.51,9.9 25.85,9.9 24.99,9.03 24.76,9.03 24.35,9.44 21.95,9.44 20.88,10.5 20.53,10.5
D-: length 17.1
  Top Layer w0.152: 33.86,9.8 USB2.A7 ; 33.86,9.8 33.9,9.76 33.9,8.96 34.07,8.79 34.27,8.79 ; 33.86,9.8 33.77,9.9 32.94,9.9 32.63,9.59 25.98,9.59 25.11,8.72 24.76,8.72 24.32,8.28 22.37,8.28 21.97,8.69 21.97,8.98 20.95,10 20.53,10
EN-PW: length 6.5
  Top Layer w0.152: v1(12.48,11.27) 12.6,11.27 12.87,11 U4.3
  Bottom Layer w0.152: 12.53,11.23 v1(12.48,11.27) 13.13,10.62 14.63,10.62 14.94,10.93 16.47,10.93 16.79,11.26 16.79,11.57
KEY0: length 14.9
  Top Layer w0.152: U4.2 13.13,11.5 12.68,11.96 ; 13.72,16.08 13.12,15.47 11.09,15.47 10,14.38 8.91,14.38 7.68,13.15
  Bottom Layer w0.152: 14.6,16.45 15,16.06 15,13.84 14.72,13.56 13.01,13.56 12.59,13.14 v1(12.59,12.13)
LED0: length 13.7
  Top Layer w0.152: 12.52,10.45 13.59,10.45 U4.4
  Bottom Layer w0.152: R11.2 3.97,8.37 7.15,8.37 7.93,9.15 9.9,9.15 10.75,10 11.56,10 12.07,10.51 v1(12.49,10.51)
PA0: length 24
  Top Layer w0.152: H1.8 18.49,16.75 17.28,15.54 15.68,15.54 15,14.86 11.41,14.86 10.19,13.64 9.62,13.64 9.21,13.24 9.21,12.32 8.58,11.69 8.58,7.94 8.85,7.67 8.85,7.19 9.97,6.06 12.07,6.06 12.47,6.46 12.47,6.84 13.12,7.5 U4.10
PA1: length 34.6
  Top Layer w0.152: U4.11 13.05,7 12.84,6.78 12.84,6.16 12.44,5.76 9.34,5.76 8.54,6.56 8.54,7.24 7.81,7.98 7.32,7.98 6.38,8.92 6.38,10.73 6.87,11.22 7.68,11.22 8.84,12.37 8.84,13.3 9.56,14.02 10.11,14.02 11.26,15.17 14.88,15.17 16.08,16.37
  Bottom Layer w0.152: v1(7.86,8.08) 7.9,8.04 9.61,8.04 9.85,8.28 9.85,8.55 10.98,9.68 13.79,9.68 14.21,10.11 15.26,10.11 15.27,10.1 ; R2.1 15.5,10.04 15.46,10.09 ; C1.2 8.57,5.58 8.88,5.89
  vias: v1(8.93,6.07)
PA2: length 24.5
  Top Layer w0.152: 11.58,16.51 9.96,14.89 6.87,14.89 5.08,13.09 5.08,5.97 5.61,5.43 12.94,5.43 13.63,6.13 U4.12
  vias: v1(5.94,5.76)
PA3: length 23.3
  Top Layer w0.152: U4.13 13.66,5.13 5.49,5.13 4.77,5.85 4.77,13.22 6.85,15.29 8.23,15.29 9.29,16.35
  vias: v1(4.72,5.46)
PA4: length 27.7
  Top Layer w0.152: 6.5,16.56 6.5,15.88 5.51,14.89 3.26,14.89 2.22,13.85 2.22,5.78 3.18,4.83 14.49,4.83 14.83,5.16 U4.14
  vias: v1(3.26,5.11)
PA5: length 28.2
  Top Layer w0.152: 3.7,16.24 2.66,15.21 2.07,15.21 0.79,13.94 0.79,5.58 1.85,4.52 14.93,4.52 15.33,4.92 U4.15
PA6: length 28.5
  Top Layer w0.152: U4.16 15.83,4.78 15.27,4.22 1.72,4.22 0.49,5.45 0.49,15.57 1.39,16.48
PA7: length 17.2
  Top Layer w0.152: U4.17 16.33,4.59 15.66,3.91 3.78,3.91 1.54,1.68
PA8: length 11.8
  Top Layer w0.152: 29.63,1.91 27.26,4.28 25.09,4.28 20.86,8.5 20.53,8.5
PA9: length 15.3
  Top Layer w0.152: 20.53,9 21.03,9 21.35,8.69 21.35,8.44 25.21,4.58 30.41,4.58 32.04,2.95 32.04,1.77
PA10: length 18
  Top Layer w0.152: 34.51,1.73 34.51,2.78 32.32,4.97 25.26,4.97 21.66,8.57 21.66,8.86 21.02,9.5 20.53,9.5
PA15: length 22.5
  Top Layer w0.152: U4.38 19.33,13.3 19.42,13.39 24.23,13.39 25.03,12.58 29.2,12.58 31.45,14.83 35.37,14.83 35.94,15.4 38.5,15.4 39.32,16.22
PB0: length 15.3
  Top Layer w0.152: U4.18 16.83,4.46 15.97,3.61 6.05,3.61 4.06,1.62
PB1: length 13.2
  Top Layer w0.152: U4.19 17.33,4.42 16.21,3.3 8.37,3.3 6.67,1.6
PB2: length 43.3
  Top Layer w0.152: 9.18,1.76 10.42,3 16.65,3 17.83,4.17 17.83,5.8
  Bottom Layer w0.152: v1(17.69,3.78) 17.69,3.52 18.52,2.69 24.99,2.69 25.64,2.05 25.64,0.99 26.25,0.38 27.71,0.38 28.15,0.82 28.15,1.91 28.88,2.64 29.51,2.64 30.56,3.69 34.91,3.69 35.56,4.34 36.28,4.34 36.67,4.73 36.67,6.85 34.75,8.76 34.75,10.97 34.45,11.28 33.54,11.28
PB3: length 20.4
  Top Layer w0.152: U4.39 18.83,13.47 19.05,13.69 20.93,13.69 21.09,13.85 24.2,13.85 25.16,12.89 28.99,12.89 31.24,15.14 35.13,15.14 36.4,16.41
PB4: length 19.5
  Top Layer w0.152: 34.57,16.53 34.57,16.11 33.9,15.44 31.11,15.44 28.86,13.19 25.28,13.19 24.26,14.21 20.85,14.22 20.63,14 18.63,14 18.33,13.7 U4.40
PB5: length 17
  Top Layer w0.152: 31.88,16.37 31.17,16.37 28.3,13.5 25.42,13.5 24.39,14.52 20.67,14.52 20.45,14.3 18.36,14.3 17.83,13.77 17.83,12.7
PB6: length 14
  Top Layer w0.152: 29.13,16.51 27.9,15.28 24.25,15.28 23.8,14.83 20.49,14.83 20.27,14.61 18.19,14.61 17.33,13.74 U4.42
PB7: length 11.9
  Top Layer w0.152: 26.44,16.23 25.79,15.58 24.05,15.58 23.6,15.13 20.36,15.13 20.14,14.91 18,14.91 17.62,14.52 17.3,14.52 16.9,14.12 16.9,12.76 U4.43
PB8: length 11
  Top Layer w0.152: U4.45 15.8,12.73 15.8,14.58 16.09,14.87 17.49,14.87 17.84,15.22 20.01,15.22 20.24,15.44 23.04,15.44 24.09,16.49
PB9: length 8.8
  Top Layer w0.152: 21.51,16.24 21.07,15.8 20.17,15.8 19.89,15.52 17.69,15.52 17.4,15.23 15.81,15.23 15.33,14.76 U4.46
PB10: length 9.7
  Top Layer w0.152: U4.21 18.33,4.47 18.23,4.36 18.23,3.53 17.39,2.69 12.81,2.69 11.69,1.57
PB12: length 7.6
  Top Layer w0.152: 20.53,6.5 21,6.03 21,4.37 19.79,3.16 18.29,3.16 16.83,1.7
PB13: length 6.5
  Top Layer w0.152: 20.53,7 21.01,7 21.39,6.62 21.39,3.5 19.71,1.82
PB14: length 6.5
  Top Layer w0.152: 22.12,1.95 21.77,2.3 21.77,6.68 20.94,7.5 20.53,7.5
PB15: length 7.8
  Top Layer w0.152: 20.53,8 20.88,8 22.09,6.79 22.09,3.64 23.92,1.81
SWCLK: length 4
  Top Layer w0.152: 23.33,11.37 22.88,11.37 21.54,12.71 19.91,12.71
SWDIO: length 3.1
  Top Layer w0.152: 23.33,10.12 21.74,10.12 20.83,11.03 20.6,11.03 20.58,11.06
USB+: length 11.3
  Top Layer w0.406: 36.03,8.24 37.11,8.24 ; 36.03,8.24 36.03,11.21 35.29,11.95 USB2.B4A9 33.64,11.95 33.31,12.28 ; 36.03,8.24 36.03,7.72 35.61,7.3 35.36,7.3 ; 37.11,8.24 37.11,7.39 37.1,7.38 ; 37.11,8.24 37.12,8.24 ; 37.11,8.24 v1(37.11,8.25) 37.12,8.24 ; 37.12,8.24 37.84,8.24 37.89,8.19 ; 37.12,8.24 37.83,7.52 37.85,7.52
  vias: v1(37.11,7.46) v1(37.93,8.23) v1(37.89,7.47)
VREF+: length 6.7
  Top Layer w0.152: 12.88,8 13.63,8 U4.9
  Bottom Layer w0.406: 12.47,7.54 12.47,7.54 ; 12.47,7.54 12.48,7.54 12.48,4.62 ; 12.47,7.54 11.86,7.98 U5.1 ; U5.2 12.4,6.08 12.43,6.1
  vias: v1(12.78,7.97)
$1N3171: length 2.4
  Top Layer w0.152: 16.35,12.61 16.35,13.94 v1(16.33,13.96)
  Bottom Layer w0.152: 16.36,13.95 16.9,13.95 R5.1
$1N3579: length 13.4
  Bottom Layer w0.152: 14.3,14.24 13.32,15.22 8.9,15.22 v1(3.5,9.81)
$1N4950: length 3.1
  Top Layer w0.254: 18.83,5.67 18.83,5.12 v1(18.93,5.02)
  Bottom Layer w0.254: 19.83,7.06 18.93,6.16 v1(18.93,5.02)
$1N5109: length 7.6
  Top Layer w0.152: 12.56,8.88 12.69,9 U4.7
  Bottom Layer w0.152: v1(7.57,6.62) 7.57,6.89 8.38,7.7 9.83,7.7 10.16,8.03 10.16,8.42 10.68,8.95 12.65,8.95
  vias: v1(12.63,8.81)
$1N7030: length 3.8
  Top Layer w0.152: 11.84,8.95 12.4,9.5 U4.6 ; 11.7,8.67 11.7,6.93 11.71,6.93
$1N7055: length 5.5
  Top Layer w0.152: 9.86,10.52 10.44,9.94 13.66,9.94 ; 10.03,11.18 10.03,12.33 C9.2
$1N11417: length 1.4
  Bottom Layer w0.152: Q3.1 16.75,10.09 16.84,10.18
$1N11548: length 9.1
  Bottom Layer w0.152: 19.5,5.49 19.47,5.45 19.47,4.8 19.15,4.49 18.71,4.49 18.4,4.8 18.4,6.14 Q3.3 ; 21.47,5.66 22.8,4.34 22.8,4.08 ; 24.03,4.12 24,4.15 R8.2 ; 21.35,5.68 21.28,5.74 Q1.2
$1N22362: length 4.1
  Bottom Layer w0.152: 24.23,7.64 24.74,8.16 U9.3
  Bottom Layer w0.254: 24.16,7.59 24.13,7.63 R9.1
$1N29393:
  vias: v1(1.51,7.99)
$1N31043: length 4
  Bottom Layer w0.152: 38.44,11.25 37.72,11.96 37.72,14.91 R12.2
$1N41930:
  vias: v1(1.66,10.84)

## Copper pours and planes (outline as drawn; the poured copper is in the pictures)
+3.3V on Bottom Layer: 20.99,9.64 27.1,9.64 27.1,8.53 20.99,8.53
GND on Top Layer: -0.24,18.37 41.24,18.37 41.24,-0.3 -0.24,-0.3
GND on Bottom Layer: -0.3,18.44 41.27,18.44 41.27,-0.34 -0.3,-0.34
BT+ on Top Layer: 30.88,8.4 32.34,8.4 32.34,7.03 30.88,7.03
BT+ on Bottom Layer: 29.89,9.27 33.1,9.27 33.1,7.09 29.89,7.09
BT+ on Bottom Layer: 29.31,9.14 30.8,9.14 30.8,8.23 29.31,8.23
USB+ on Bottom Layer: 37.16,9.03 39.96,9.03 39.96,1.39 37.16,1.39
$1N17740 on Bottom Layer: 28.93,11.29 30.52,11.29 30.52,9.57 28.93,9.57
$1N17819 on Bottom Layer: 25.93,11.29 27.53,11.29 27.53,9.53 25.93,9.53

## Text on the board
Bottom Silkscreen Layer: 2022/7/4 | F401COREv1T
Top Silkscreen Layer: A6 | A2++ | C13 | A1 | A0 | B3++ | A15 | A7 | B0 | B1 | B2 | B10 | B+ | B12 | B14 | B13 | 3V | A8 | A9 | A10 | G | 5V | B9
